# Altium project Microprocessor.PrjPcb
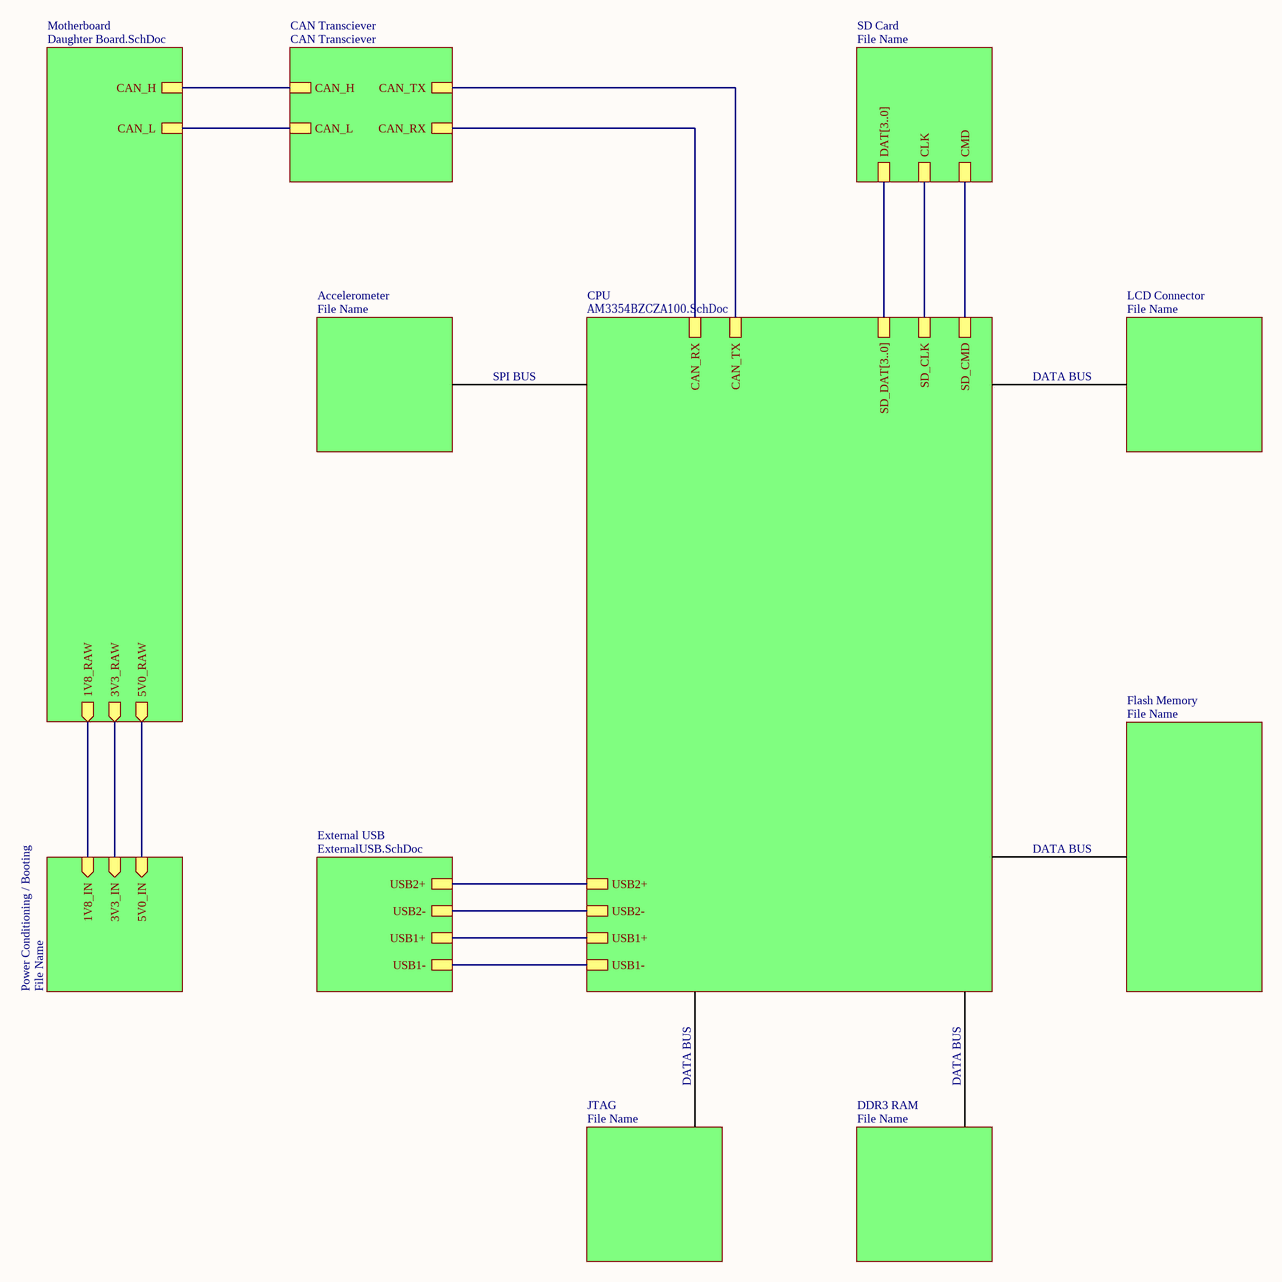
[diagram p0: BlockView.SchDoc]
8 sheets, 31 parts. Net scope: hierarchical (ports join the sheet entries above them; power ports are global).
Board file: Microprocessor.PcbDoc
Sheets:
  BlockView.SchDoc
    Motherboard = Daughter Board.SchDoc
  AM-Power.SchDoc
  AM-Config&LCD.SchDoc
  AM-Clock.SchDoc
  AM-IO.SchDoc
  AM-ExternalMemory.SchDoc
  AM-RAM.SchDoc

## Sheet BlockView.SchDoc
size C

### Sub-sheets
Accelerometer = File Name (file not in this document): no entries
CAN Transciever = CAN Transciever (file not in this document): CAN_H, CAN_L, CAN_TX, CAN_RX
CPU = AM3354BZCZA100​.SchDoc (file not in this document): USB2+, USB2-, CAN_TX, CAN_RX, SD_DAT[3..0], SD_CLK, SD_CMD, USB1+, USB1-
DDR3 RAM = File Name (file not in this document): no entries
External USB = ExternalUSB.SchDoc (file not in this document): USB2+, USB2-, USB1+, USB1-
Flash Memory = File Name (file not in this document): no entries
JTAG = File Name (file not in this document): no entries
LCD Connector = File Name (file not in this document): no entries
Motherboard = Daughter Board.SchDoc: CAN_H, CAN_L, 1V8_RAW (out), 5V0_RAW (out), 3V3_RAW (out)
Power Conditioning / Booting = File Name (file not in this document): 1V8_IN (in), 3V3_IN (in), 5V0_IN (in)
SD Card = File Name (file not in this document): DAT[3..0], CLK, CMD

### Nets
(unnamed): sheet Motherboard/CAN_H, sheet CAN Transciever/CAN_H
(unnamed): sheet Motherboard/CAN_L, sheet CAN Transciever/CAN_L
(unnamed): sheet Motherboard/1V8_RAW, sheet Power Conditioning / Booting/1V8_IN
(unnamed): sheet Motherboard/5V0_RAW, sheet Power Conditioning / Booting/5V0_IN
(unnamed): sheet Motherboard/3V3_RAW, sheet Power Conditioning / Booting/3V3_IN
(unnamed): sheet CPU/USB2+, sheet External USB/USB2+
(unnamed): sheet CPU/USB2-, sheet External USB/USB2-
(unnamed): sheet CPU/CAN_TX, sheet CAN Transciever/CAN_TX
(unnamed): sheet CPU/CAN_RX, sheet CAN Transciever/CAN_RX
(unnamed): sheet CPU/SD_DAT[3..0], sheet SD Card/DAT[3..0]
(unnamed): sheet CPU/SD_CLK, sheet SD Card/CLK
(unnamed): sheet CPU/SD_CMD, sheet SD Card/CMD
(unnamed): sheet CPU/USB1+, sheet External USB/USB1+
(unnamed): sheet CPU/USB1-, sheet External USB/USB1-

### Notes on the sheet
- SPI BUS
- DATA BUS

## Sheet Daughter Board.SchDoc
size A
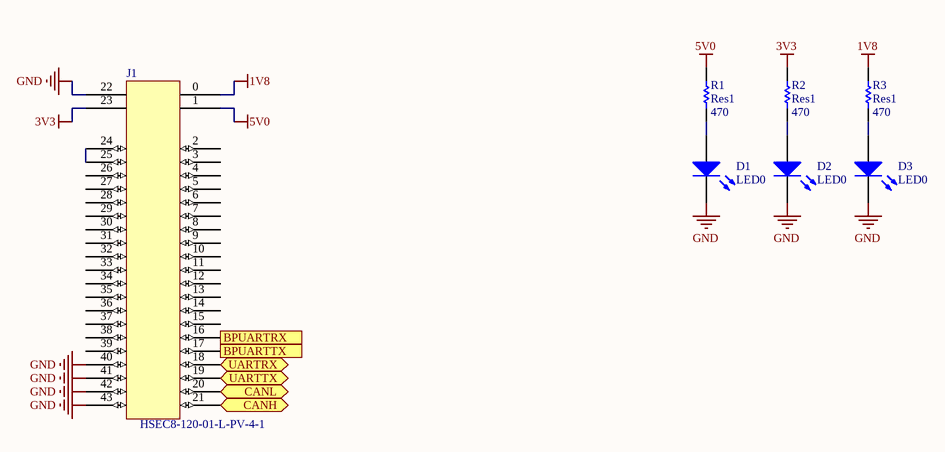
[diagram p1: Daughter Board.SchDoc]

### Parts
D1  LED0  [1608[0603]]
D2  LED0  [1608[0603]]
D3  LED0  [1608[0603]]
J1  HSEC8-120-01-L-PV-4-1  [HSEC8-120-01-L-PV-4-1 Gold Fingers]
R1  Res1  value 470  [1608[0603]]
R2  Res1  value 470  [1608[0603]]
R3  Res1  value 470  [1608[0603]]

### Ports
BPUARTRX (out), BPUARTTX (in), CANH (bidir), CANL (bidir), UARTRX (bidir), UARTTX (bidir)

### Nets
1V8: J1.0 R3.2
3V3: J1.23 R2.2
5V0: J1.1 R1.2
GND: D1.2(K) D2.2(K) D3.2(K) J1.22 J1.40 J1.41 J1.42 J1.43
NetD1_1: D1.1(A) R1.1
NetD2_1: D2.1(A) R2.1
NetD3_1: D3.1(A) R3.1
NetJ1_16: J1.16 ; port BPUARTRX
NetJ1_17: J1.17 ; port BPUARTTX
NetJ1_18: J1.18 ; port UARTRX
NetJ1_19: J1.19 ; port UARTTX
NetJ1_20: J1.20 ; port CANL
NetJ1_21: J1.21 ; port CANH
NetJ1_24: J1.24 J1.25

Not connected (* = marked no-connect by the designer): J1 2(0) 3(0) 4(0) 5(0) 6(0) 7(0) 8(0) 9(0) 10(0) 11(0) 12(0) 13(0) 14(0) 15(0) 26 27 28 29 30 31 32 33 34 35 36 37 38 39

### Library data of the parts
R1-R3 = Res1: Resistor; Published: 8-Jun-2000; LatestRevisionDate: 17-Jul-2002; LatestRevisionNote: Re-released for DXP Platform.; PackageReference: AXIAL-0.3; Publisher: Altium Limited; PackageDescription: Axial Device, Thru-Hole; 2 Leads; 0.3 in Pin Spacing
D1-D3 = LED0: Published: 8-Jun-2000; LatestRevisionDate: 08-Jul-2005; LatestRevisionNote: Mech Layer 1 removed.; PackageReference: LED-0; Publisher: Altium Limited; PackageDescription: LED; 2 Leads
J1 = HSEC8-120-01-L-PV-4-1: Supplier 1: Mouser

## Sheet AM-Power.SchDoc
size C
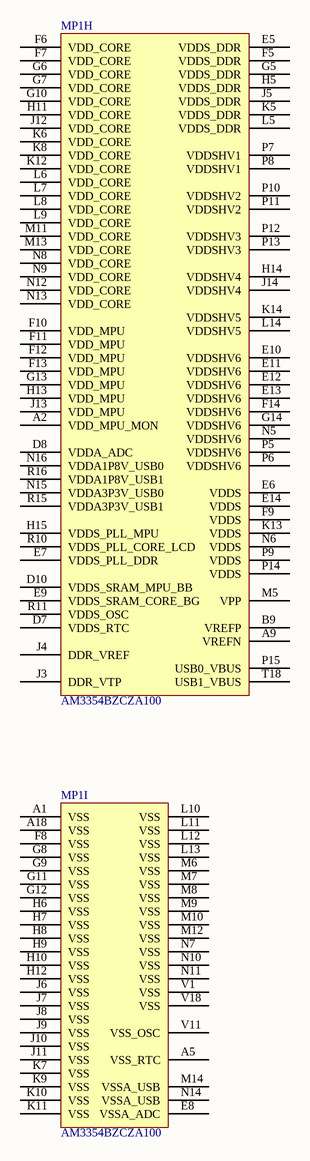
[diagram p2: AM-Power.SchDoc]

### Parts
MP1  AM3354BZCZA100  [TI-ZCZ324]  (parts H,I of 9)

### Nets

Not connected (* = marked no-connect by the designer): MP1 A1(VSS) A2(VDD_MPU_MON) A5(VSS_RTC) A9(VREFN) A18(VSS) B9(VREFP) D7(VDDS_RTC) D8(VDDA_ADC) D10(VDDS_SRAM_MPU_BB) E5(VDDS_DDR) E6(VDDS) E7(VDDS_PLL_DDR) E8(VSSA_ADC) E9(VDDS_SRAM_CORE_BG) E10(VDDSHV6) E11(VDDSHV6) E12(VDDSHV6) E13(VDDSHV6) E14(VDDS) F5(VDDS_DDR) F6(VDD_CORE) F7(VDD_CORE) F8(VSS) F9(VDDS) F10(VDD_MPU) F11(VDD_MPU) F12(VDD_MPU) F13(VDD_MPU) F14(VDDSHV6) G5(VDDS_DDR) G6(VDD_CORE) G7(VDD_CORE) G8(VSS) G9(VSS) G10(VDD_CORE) G11(VSS) G12(VSS) G13(VDD_MPU) G14(VDDSHV6) H5(VDDS_DDR) H6(VSS) H7(VSS) H8(VSS) H9(VSS) H10(VSS) H11(VDD_CORE) H12(VSS) H13(VDD_MPU) H14(VDDSHV4) H15(VDDS_PLL_MPU) J3(DDR_VTP) J4(DDR_VREF) J5(VDDS_DDR) J6(VSS) J7(VSS) J8(VSS) J9(VSS) J10(VSS) J11(VSS) J12(VDD_CORE) J13(VDD_MPU) J14(VDDSHV4) K5(VDDS_DDR) K6(VDD_CORE) K7(VSS) K8(VDD_CORE) K9(VSS) K10(VSS) K11(VSS) K12(VDD_CORE) K13(VDDS) K14(VDDSHV5) L5(VDDS_DDR) L6(VDD_CORE) L7(VDD_CORE) L8(VDD_CORE) L9(VDD_CORE) L10(VSS) L11(VSS) L12(VSS) L13(VSS) L14(VDDSHV5) M5(VPP) M6(VSS) M7(VSS) M8(VSS) M9(VSS) M10(VSS) M11(VDD_CORE) M12(VSS) M13(VDD_CORE) M14(VSSA_USB) N5(VDDSHV6) N6(VDDS) N7(VSS) N8(VDD_CORE) N9(VDD_CORE) N10(VSS) N11(VSS) N12(VDD_CORE) N13(VDD_CORE) N14(VSSA_USB) N15(VDDA3P3V_USB0) N16(VDDA1P8V_USB0) P5(VDDSHV6) P6(VDDSHV6) P7(VDDSHV1) P8(VDDSHV1) P9(VDDS) P10(VDDSHV2) P11(VDDSHV2) P12(VDDSHV3) P13(VDDSHV3) P14(VDDS) P15(USB0_VBUS) R10(VDDS_PLL_CORE_LCD) R11(VDDS_OSC) R15(VDDA3P3V_USB1) R16(VDDA1P8V_USB1) T18(USB1_VBUS) V1(VSS) V11(VSS_OSC) V18(VSS)

### Notes on the sheet
- Title
- Size:
- Date:
- File:
- C
- Number:
- Time:
- Revision:
- Sheet
- of

### Library data of the parts
MP1 = CMP-0547-00017-2: Sitara ARM Cortex-A8 32-Bit RISC Microprocessor, 1 GHz, SGX530 3D Graphics Engine, Programmable Real-Time Unit and Industrial Communication Subsystem (PRU-ICSS), -40 to 105 degC, 324-pin NFBGA (ZCZ), Green (RoHS & no Sb/Br); Manufacturer: Texas Instruments; eQEP: 3; CAN: 2; UART (SCI): 6; ComponentLink2Description: Datasheet; Mounting Technology: Surface Mount; ComponentLink3Description: Package Specification; Operating Temperature: -40 to 105 degC; PackageReference: ZCZ324; ComponentLink3URL: http://www.ti.com/lit/ds/symlink/am3352.pdf; ARM CPU: Cortex-A8; SPI: 2; ComponentLink2URL: http://www.ti.com/lit/ds/symlink/am3352.pdf; ComponentLink1URL: http://www.ti.com/; PackageVersion: 4211570/A; DatasheetVersion: SPRS717F; eCAP: 3; ComponentLink1Description: Manufacturer URL; PartNumber: AM3354BZCZA100; I2C: 3; PackageDescription: 324-Pin Plastic Ball Grid Array, Body 15 x 15 mm, Pitch 0.8 mm

## Sheet AM-Config&LCD.SchDoc
size A
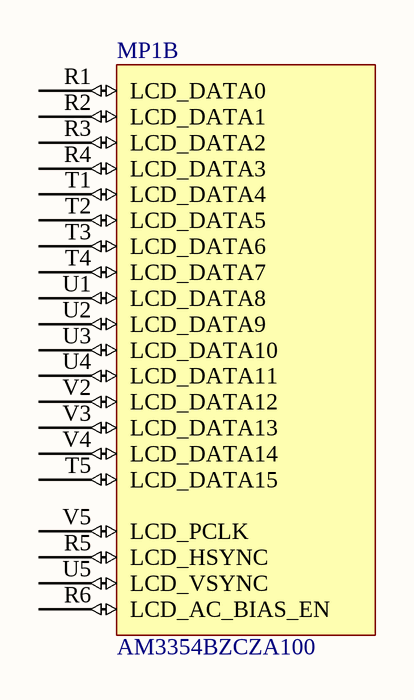
[diagram p3: AM-Config&LCD.SchDoc]

### Parts
MP1  AM3354BZCZA100  [TI-ZCZ324]  (part B of 9)

### Nets

Not connected (* = marked no-connect by the designer): MP1 R1(LCD_DATA0) R2(LCD_DATA1) R3(LCD_DATA2) R4(LCD_DATA3) R5(LCD_HSYNC) R6(LCD_AC_BIAS_EN) T1(LCD_DATA4) T2(LCD_DATA5) T3(LCD_DATA6) T4(LCD_DATA7) T5(LCD_DATA15) U1(LCD_DATA8) U2(LCD_DATA9) U3(LCD_DATA10) U4(LCD_DATA11) U5(LCD_VSYNC) V2(LCD_DATA12) V3(LCD_DATA13) V4(LCD_DATA14) V5(LCD_PCLK)

### Library data of the parts
MP1 = CMP-0547-00017-2: as MP1 on sheet AM-Power; ComponentLink2Description: Datasheet; Mounting Technology: Surface Mount; ComponentLink3Description: Package Specification; Operating Temperature: -40 to 105 degC; PackageReference: ZCZ324; ComponentLink3URL: http://www.ti.com/lit/ds/symlink/am3352.pdf; ARM CPU: Cortex-A8; SPI: 2; ComponentLink2URL: http://www.ti.com/lit/ds/symlink/am3352.pdf; ComponentLink1URL: http://www.ti.com/; PackageVersion: 4211570/A; DatasheetVersion: SPRS717F; eCAP: 3; ComponentLink1Description: Manufacturer URL; PartNumber: AM3354BZCZA100; I2C: 3; PackageDescription: 324-Pin Plastic Ball Grid Array, Body 15 x 15 mm, Pitch 0.8 mm

## Sheet AM-Clock.SchDoc
size A
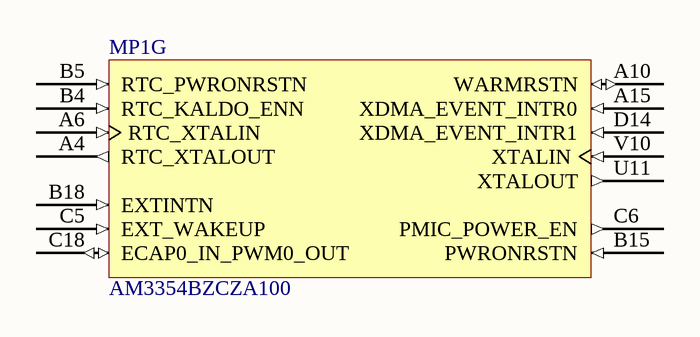
[diagram p4: AM-Clock.SchDoc]

### Parts
MP1  AM3354BZCZA100  [TI-ZCZ324]  (part G of 9)

### Nets

Not connected (* = marked no-connect by the designer): MP1 A4(RTC_XTALOUT) A6(RTC_XTALIN) A10(WARMRSTN) A15(XDMA_EVENT_INTR0) B4(RTC_KALDO_ENN) B5(RTC_PWRONRSTN) B15(PWRONRSTN) B18(EXTINTN) C5(EXT_WAKEUP) C6(PMIC_POWER_EN) C18(ECAP0_IN_PWM0_OUT) D14(XDMA_EVENT_INTR1) U11(XTALOUT) V10(XTALIN)

### Library data of the parts
MP1 = CMP-0547-00017-2: as MP1 on sheet AM-Power; ComponentLink2Description: Datasheet; Mounting Technology: Surface Mount; ComponentLink3Description: Package Specification; Operating Temperature: -40 to 105 degC; PackageReference: ZCZ324; ComponentLink3URL: http://www.ti.com/lit/ds/symlink/am3352.pdf; ARM CPU: Cortex-A8; SPI: 2; ComponentLink2URL: http://www.ti.com/lit/ds/symlink/am3352.pdf; ComponentLink1URL: http://www.ti.com/; PackageVersion: 4211570/A; DatasheetVersion: SPRS717F; eCAP: 3; ComponentLink1Description: Manufacturer URL; PartNumber: AM3354BZCZA100; I2C: 3; PackageDescription: 324-Pin Plastic Ball Grid Array, Body 15 x 15 mm, Pitch 0.8 mm

## Sheet AM-IO.SchDoc
size A
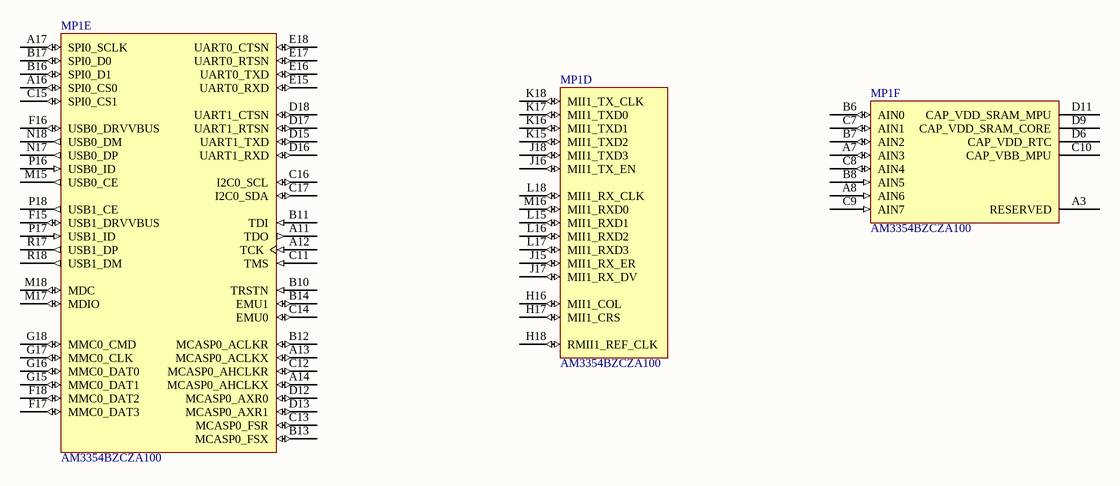
[diagram p5: AM-IO.SchDoc]

### Parts
MP1  AM3354BZCZA100  [TI-ZCZ324]  (parts D,E,F of 9)

### Nets

Not connected (* = marked no-connect by the designer): MP1 A3(RESERVED) A7(AIN3) A8(AIN6) A11(TDO) A12(TCK) A13(MCASP0_ACLKX) A14(MCASP0_AHCLKX) A16(SPI0_CS0) A17(SPI0_SCLK) B6(AIN0) B7(AIN2) B8(AIN5) B10(TRSTN) B11(TDI) B12(MCASP0_ACLKR) B13(MCASP0_FSX) B14(EMU1) B16(SPI0_D1) B17(SPI0_D0) C7(AIN1) C8(AIN4) C9(AIN7) C10(CAP_VBB_MPU) C11(TMS) C12(MCASP0_AHCLKR) C13(MCASP0_FSR) C14(EMU0) C15(SPI0_CS1) C16(I2C0_SCL) C17(I2C0_SDA) D6(CAP_VDD_RTC) D9(CAP_VDD_SRAM_CORE) D11(CAP_VDD_SRAM_MPU) D12(MCASP0_AXR0) D13(MCASP0_AXR1) D15(UART1_TXD) D16(UART1_RXD) D17(UART1_RTSN) D18(UART1_CTSN) E15(UART0_RXD) E16(UART0_TXD) E17(UART0_RTSN) E18(UART0_CTSN) F15(USB1_DRVVBUS) F16(USB0_DRVVBUS) F17(MMC0_DAT3) F18(MMC0_DAT2) G15(MMC0_DAT1) G16(MMC0_DAT0) G17(MMC0_CLK) G18(MMC0_CMD) H16(MII1_COL) H17(MII1_CRS) H18(RMII1_REF_CLK) J15(MII1_RX_ER) J16(MII1_TX_EN) J17(MII1_RX_DV) J18(MII1_TXD3) K15(MII1_TXD2) K16(MII1_TXD1) K17(MII1_TXD0) K18(MII1_TX_CLK) L15(MII1_RXD1) L16(MII1_RXD2) L17(MII1_RXD3) L18(MII1_RX_CLK) M15(USB0_CE) M16(MII1_RXD0) M17(MDIO) M18(MDC) N17(USB0_DP) N18(USB0_DM) P16(USB0_ID) P17(USB1_ID) P18(USB1_CE) R17(USB1_DP) R18(USB1_DM)

### Library data of the parts
MP1 = CMP-0547-00017-2: as MP1 on sheet AM-Power; ComponentLink2Description: Datasheet; Mounting Technology: Surface Mount; ComponentLink3Description: Package Specification; Operating Temperature: -40 to 105 degC; PackageReference: ZCZ324; ComponentLink3URL: http://www.ti.com/lit/ds/symlink/am3352.pdf; ARM CPU: Cortex-A8; SPI: 2; ComponentLink2URL: http://www.ti.com/lit/ds/symlink/am3352.pdf; ComponentLink1URL: http://www.ti.com/; PackageVersion: 4211570/A; DatasheetVersion: SPRS717F; eCAP: 3; ComponentLink1Description: Manufacturer URL; PartNumber: AM3354BZCZA100; I2C: 3; PackageDescription: 324-Pin Plastic Ball Grid Array, Body 15 x 15 mm, Pitch 0.8 mm

## Sheet AM-ExternalMemory.SchDoc
size A
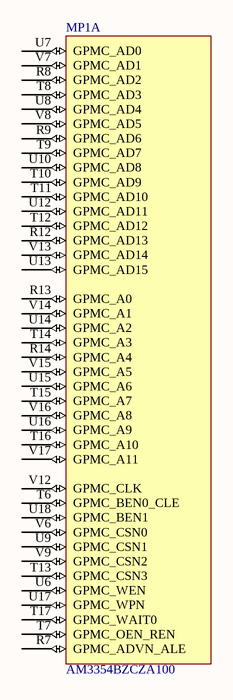
[diagram p6: AM-ExternalMemory.SchDoc]

### Parts
MP1  AM3354BZCZA100  [TI-ZCZ324]  (part A of 9)

### Nets

Not connected (* = marked no-connect by the designer): MP1 R7(GPMC_ADVN_ALE) R8(GPMC_AD2) R9(GPMC_AD6) R12(GPMC_AD13) R13(GPMC_A0) R14(GPMC_A4) T6(GPMC_BEN0_CLE) T7(GPMC_OEN_REN) T8(GPMC_AD3) T9(GPMC_AD7) T10(GPMC_AD9) T11(GPMC_AD10) T12(GPMC_AD12) T13(GPMC_CSN3) T14(GPMC_A3) T15(GPMC_A7) T16(GPMC_A10) T17(GPMC_WAIT0) U6(GPMC_WEN) U7(GPMC_AD0) U8(GPMC_AD4) U9(GPMC_CSN1) U10(GPMC_AD8) U12(GPMC_AD11) U13(GPMC_AD15) U14(GPMC_A2) U15(GPMC_A6) U16(GPMC_A9) U17(GPMC_WPN) U18(GPMC_BEN1) V6(GPMC_CSN0) V7(GPMC_AD1) V8(GPMC_AD5) V9(GPMC_CSN2) V12(GPMC_CLK) V13(GPMC_AD14) V14(GPMC_A1) V15(GPMC_A5) V16(GPMC_A8) V17(GPMC_A11)

### Library data of the parts
MP1 = CMP-0547-00017-2: as MP1 on sheet AM-Power; ComponentLink2Description: Datasheet; Mounting Technology: Surface Mount; ComponentLink3Description: Package Specification; Operating Temperature: -40 to 105 degC; PackageReference: ZCZ324; ComponentLink3URL: http://www.ti.com/lit/ds/symlink/am3352.pdf; ARM CPU: Cortex-A8; SPI: 2; ComponentLink2URL: http://www.ti.com/lit/ds/symlink/am3352.pdf; ComponentLink1URL: http://www.ti.com/; PackageVersion: 4211570/A; DatasheetVersion: SPRS717F; eCAP: 3; ComponentLink1Description: Manufacturer URL; PartNumber: AM3354BZCZA100; I2C: 3; PackageDescription: 324-Pin Plastic Ball Grid Array, Body 15 x 15 mm, Pitch 0.8 mm

## Sheet AM-RAM.SchDoc
size B
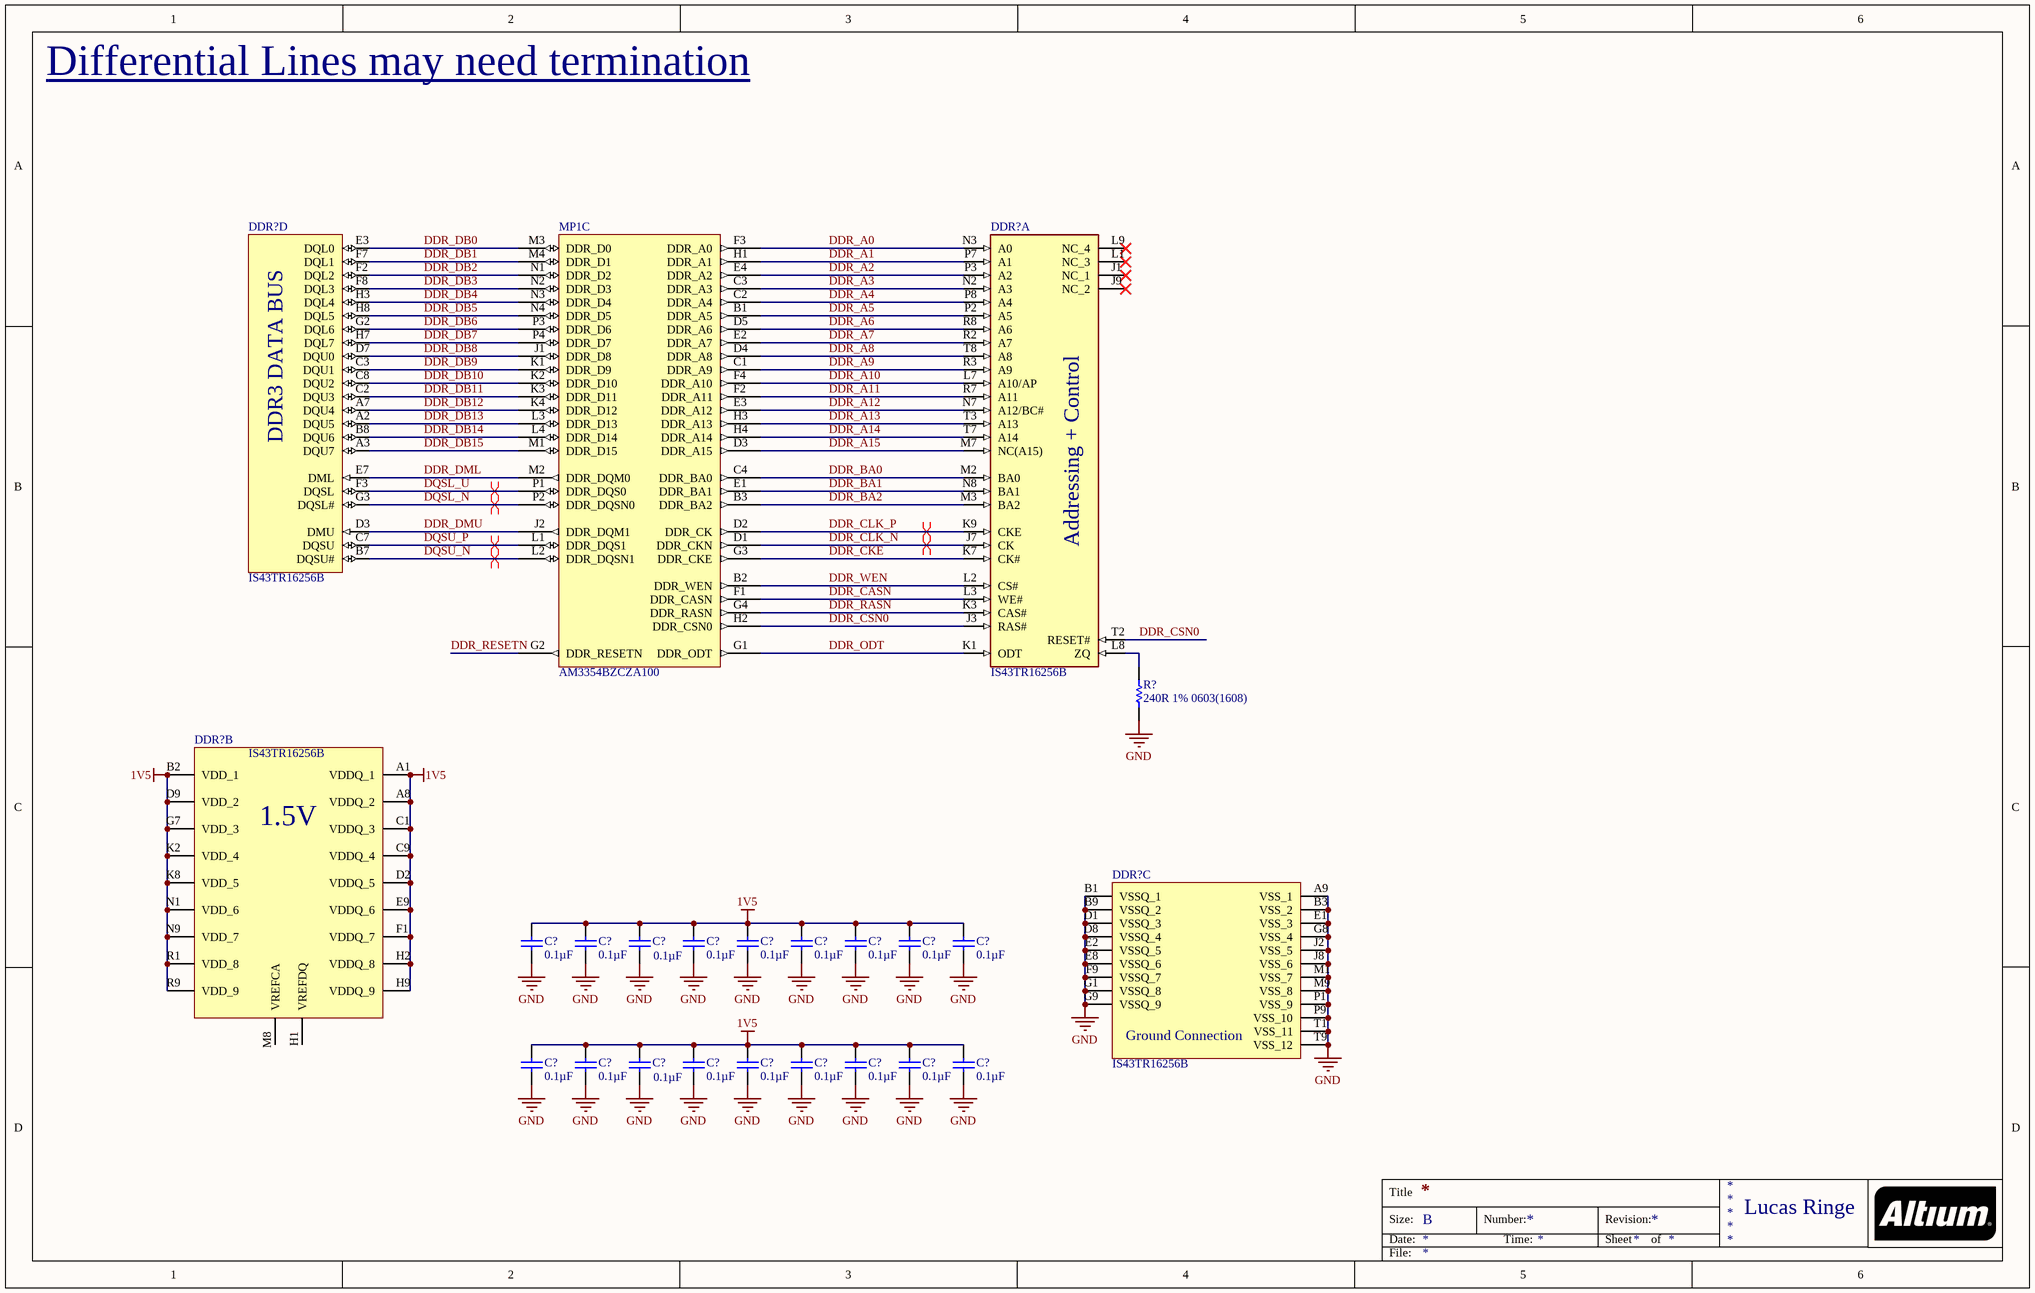
[diagram p7: AM-RAM.SchDoc]

### Parts
(Parts that share a designator on the sheet are numbered #1, #2 ... from top to bottom, then left to right.)
C?#1  Capacitance: 0.1µF  [SAMS-C0603-2_M]  (hidden comment: CL10B104KB8NNNC)
C?#2  Capacitance: 0.1µF  [SAMS-C0603-2_M]  (hidden comment: CL10B104KB8NNNC)
C?#3  Capacitance: 0.1µF  [SAMS-C0603-2_M]  (hidden comment: CL10B104KB8NNNC)
C?#4  Capacitance: 0.1µF  [SAMS-C0603-2_M]  (hidden comment: CL10B104KB8NNNC)
C?#5  Capacitance: 0.1µF  [SAMS-C0603-2_M]  (hidden comment: CL10B104KB8NNNC)
C?#6  Capacitance: 0.1µF  [SAMS-C0603-2_M]  (hidden comment: CL10B104KB8NNNC)
C?#7  Capacitance: 0.1µF  [SAMS-C0603-2_M]  (hidden comment: CL10B104KB8NNNC)
C?#8  Capacitance: 0.1µF  [SAMS-C0603-2_M]  (hidden comment: CL10B104KB8NNNC)
C?#9  Capacitance: 0.1µF  [SAMS-C0603-2_M]  (hidden comment: CL10B104KB8NNNC)
C?#10  Capacitance: 0.1µF  [SAMS-C0603-2_M]  (hidden comment: CL10B104KB8NNNC)
C?#11  Capacitance: 0.1µF  [SAMS-C0603-2_M]  (hidden comment: CL10B104KB8NNNC)
C?#12  Capacitance: 0.1µF  [SAMS-C0603-2_M]  (hidden comment: CL10B104KB8NNNC)
C?#13  Capacitance: 0.1µF  [SAMS-C0603-2_M]  (hidden comment: CL10B104KB8NNNC)
C?#14  Capacitance: 0.1µF  [SAMS-C0603-2_M]  (hidden comment: CL10B104KB8NNNC)
C?#15  Capacitance: 0.1µF  [SAMS-C0603-2_M]  (hidden comment: CL10B104KB8NNNC)
C?#16  Capacitance: 0.1µF  [SAMS-C0603-2_M]  (hidden comment: CL10B104KB8NNNC)
C?#17  Capacitance: 0.1µF  [SAMS-C0603-2_M]  (hidden comment: CL10B104KB8NNNC)
C?#18  Capacitance: 0.1µF  [SAMS-C0603-2_M]  (hidden comment: CL10B104KB8NNNC)
DDR?#1  IS43TR16256B  [BGA96C80P9X16_900X1300X120]  (part D of 4)
DDR?#2  IS43TR16256B  [BGA96C80P9X16_900X1300X120]  (part A of 4)
DDR?#3  IS43TR16256B  [BGA96C80P9X16_900X1300X120]  (part B of 4)
DDR?#4  IS43TR16256B  [BGA96C80P9X16_900X1300X120]  (part C of 4)
MP1  AM3354BZCZA100  [TI-ZCZ324]  (part C of 9)
R?  240R 1% 0603(1608)  [RESC0603(1608)_N]

### Nets
1V5: C?#1.2 C?#2.2 C?#3.2 C?#4.2 C?#5.2 C?#6.2 C?#7.2 C?#8.2 C?#9.2 C?#10.2 C?#11.2 C?#12.2 C?#13.2 C?#14.2 C?#15.2 C?#16.2 C?#17.2 C?#18.2 DDR?#3.A1(VDDQ_1) DDR?#3.A8(VDDQ_2) DDR?#3.B2(VDD_1) DDR?#3.C1(VDDQ_3) DDR?#3.C9(VDDQ_4) DDR?#3.D2(VDDQ_5) DDR?#3.D9(VDD_2) DDR?#3.E9(VDDQ_6) DDR?#3.F1(VDDQ_7) DDR?#3.G7(VDD_3) DDR?#3.H2(VDDQ_8) DDR?#3.H9(VDDQ_9) DDR?#3.K2(VDD_4) DDR?#3.K8(VDD_5) DDR?#3.N1(VDD_6) DDR?#3.N9(VDD_7) DDR?#3.R1(VDD_8) DDR?#3.R9(VDD_9)
GND: C?#1.1 C?#2.1 C?#3.1 C?#4.1 C?#5.1 C?#6.1 C?#7.1 C?#8.1 C?#9.1 C?#10.1 C?#11.1 C?#12.1 C?#13.1 C?#14.1 C?#15.1 C?#16.1 C?#17.1 C?#18.1 DDR?#4.A9(VSS_1) DDR?#4.B1(VSSQ_1) DDR?#4.B3(VSS_2) DDR?#4.B9(VSSQ_2) DDR?#4.D1(VSSQ_3) DDR?#4.D8(VSSQ_4) DDR?#4.E1(VSS_3) DDR?#4.E2(VSSQ_5) DDR?#4.E8(VSSQ_6) DDR?#4.F9(VSSQ_7) DDR?#4.G1(VSSQ_8) DDR?#4.G8(VSS_4) DDR?#4.G9(VSSQ_9) DDR?#4.J2(VSS_5) DDR?#4.J8(VSS_6) DDR?#4.M1(VSS_7) DDR?#4.M9(VSS_8) DDR?#4.P1(VSS_9) DDR?#4.P9(VSS_10) DDR?#4.T1(VSS_11) DDR?#4.T9(VSS_12) R?.1
DDR_A0: DDR?#2.N3(A0) MP1.F3(DDR_A0)
DDR_A1: DDR?#2.P7(A1) MP1.H1(DDR_A1)
DDR_A2: DDR?#2.P3(A2) MP1.E4(DDR_A2)
DDR_A3: DDR?#2.N2(A3) MP1.C3(DDR_A3)
DDR_A4: DDR?#2.P8(A4) MP1.C2(DDR_A4)
DDR_A5: DDR?#2.P2(A5) MP1.B1(DDR_A5)
DDR_A6: DDR?#2.R8(A6) MP1.D5(DDR_A6)
DDR_A7: DDR?#2.R2(A7) MP1.E2(DDR_A7)
DDR_A8: DDR?#2.T8(A8) MP1.D4(DDR_A8)
DDR_A9: DDR?#2.R3(A9) MP1.C1(DDR_A9)
DDR_A10: DDR?#2.L7(A10/AP) MP1.F4(DDR_A10)
DDR_A11: DDR?#2.R7(A11) MP1.F2(DDR_A11)
DDR_A1~{2}: DDR?#2.N7(A12/BC#) MP1.E3(DDR_A12)
DDR_A13: DDR?#2.T3(A13) MP1.H3(DDR_A13)
DDR_A14: DDR?#2.T7(A14) MP1.H4(DDR_A14)
DDR_A15: DDR?#2.M7(NC(A15)) MP1.D3(DDR_A15)
DDR_BA0: DDR?#2.M2(BA0) MP1.C4(DDR_BA0)
DDR_BA1: DDR?#2.N8(BA1) MP1.E1(DDR_BA1)
DDR_BA2: DDR?#2.M3(BA2) MP1.B3(DDR_BA2)
DDR_CASN: DDR?#2.L3(WE#) MP1.F1(DDR_CASN)
DDR_CKE: DDR?#2.K7(CK#) MP1.G3(DDR_CKE)
DDR_CLK_N: DDR?#2.J7(CK) MP1.D1(DDR_CKN)
DDR_CLK_P: DDR?#2.K9(CKE) MP1.D2(DDR_CK)
DDR_CSN0: DDR?#2.J3(RAS#) DDR?#2.T2(RESET#) MP1.H2(DDR_CSN0)
DDR_DB0: DDR?#1.E3(DQL0) MP1.M3(DDR_D0)
DDR_DB1: DDR?#1.F7(DQL1) MP1.M4(DDR_D1)
DDR_DB2: DDR?#1.F2(DQL2) MP1.N1(DDR_D2)
DDR_DB3: DDR?#1.F8(DQL3) MP1.N2(DDR_D3)
DDR_DB4: DDR?#1.H3(DQL4) MP1.N3(DDR_D4)
DDR_DB5: DDR?#1.H8(DQL5) MP1.N4(DDR_D5)
DDR_DB6: DDR?#1.G2(DQL6) MP1.P3(DDR_D6)
DDR_DB7: DDR?#1.H7(DQL7) MP1.P4(DDR_D7)
DDR_DB8: DDR?#1.D7(DQU0) MP1.J1(DDR_D8)
DDR_DB9: DDR?#1.C3(DQU1) MP1.K1(DDR_D9)
DDR_DB10: DDR?#1.C8(DQU2) MP1.K2(DDR_D10)
DDR_DB11: DDR?#1.C2(DQU3) MP1.K3(DDR_D11)
DDR_DB12: DDR?#1.A7(DQU4) MP1.K4(DDR_D12)
DDR_DB13: DDR?#1.A2(DQU5) MP1.L3(DDR_D13)
DDR_DB14: DDR?#1.B8(DQU6) MP1.L4(DDR_D14)
DDR_DB15: DDR?#1.A3(DQU7) MP1.M1(DDR_D15)
DDR_DML: DDR?#1.E7(DML) MP1.M2(DDR_DQM0)
DDR_DMU: DDR?#1.D3(DMU) MP1.J2(DDR_DQM1)
DDR_ODT: DDR?#2.K1(ODT) MP1.G1(DDR_ODT)
DDR_RASN: DDR?#2.K3(CAS#) MP1.G4(DDR_RASN)
DDR_RESETN: MP1.G2(DDR_RESETN)
DDR_WEN: DDR?#2.L2(CS#) MP1.B2(DDR_WEN)
DQSL_N: DDR?#1.G3(DQSL#) MP1.P2(DDR_DQSN0)
DQSL_U: DDR?#1.F3(DQSL) MP1.P1(DDR_DQS0)
DQSU_N: DDR?#1.B7(DQSU#) MP1.L2(DDR_DQSN1)
DQSU_P: DDR?#1.C7(DQSU) MP1.L1(DDR_DQS1)
NetDDR?#2_L8: DDR?#2.L8(ZQ) R?.2

Not connected (* = marked no-connect by the designer): DDR?#2 J1(NC_1)* J9(NC_2)* L1(NC_3)* L9(NC_4)*; DDR?#3 H1(VREFDQ) M8(VREFCA)

### Layout directives
differential pair: DDR_CLK_N, DDR_CLK_P, DQSL_N, DQSL_U, DQSU_N, DQSU_P

### Notes on the sheet
- Differential Lines may need termination <https://www.nxp.com/files-static/32bit/doc/app_note/AN3940.pdf>
- Lucas Ringe
- Title
- Size:
- Date:
- B
- Number:
- Time:
- Revision:
- Sheet
- of
- File:
- (in symbol IS43TR16256B, part A) Addressing + Control
- (in symbol IS43TR16256B, part B) 1.5V
- (in symbol IS43TR16256B, part C) Ground Connection
- (in symbol IS43TR16256B, part D) DDR3 DATA BUS

### Library data of the parts
C?#1-C?#18 = CMP-2000-05332-1: Multi-layer Ceramic Capacitor, -55 to 125 degC, 2-Pin SMD (0603), RoHS, Tape and Reel; Manufacturer: Samsung Electro-Mechanics; Rated Voltage: 50V; Dielectric: X7R; Tolerance (%): ±10%; Case Size/Dimension: 0603; Datasheet URL: https://datasheet.ciiva.com/29198/456651-da-01-en-vs-kondensator-0605-29198839.pdf; Manufacturer URL: http://www.samsungsem.com/global/index.jsp; Datasheet Version: Nov-10
DDR?#1-DDR?#4 = IS43TR16256B: Integrated Circuit; Manufacturer_Name: Integrated Silicon Solution Inc.; Manufacturer_Part_Number: IS43TR16256B-125KBL; Datasheet Link: https://componentsearchengine.com//IS43TR16256B-125KBL.pdf; Height: 1.2mm; Mouser2 Part Number: 870-43T16256B125KBL; Mouser2 Price/Stock: https://www.mouser.com/Search/Refine.aspx?Keyword=870-43T16256B125KBL
MP1 = CMP-0547-00017-2: as MP1 on sheet AM-Power; ComponentLink2Description: Datasheet; Mounting Technology: Surface Mount; ComponentLink3Description: Package Specification; Operating Temperature: -40 to 105 degC; PackageReference: ZCZ324; ComponentLink3URL: http://www.ti.com/lit/ds/symlink/am3352.pdf; ARM CPU: Cortex-A8; SPI: 2; ComponentLink2URL: http://www.ti.com/lit/ds/symlink/am3352.pdf; ComponentLink1URL: http://www.ti.com/; PackageVersion: 4211570/A; DatasheetVersion: SPRS717F; eCAP: 3; ComponentLink1Description: Manufacturer URL; PartNumber: AM3354BZCZA100; I2C: 3; PackageDescription: 324-Pin Plastic Ball Grid Array, Body 15 x 15 mm, Pitch 0.8 mm
R? = CMP-1012-00438-1: 240R 0.1W 1% 0603 (1608 Metric)  SMD; Case-EIA: 0603; Value: 240.00 Ohm; Case-Metric: 1608; Technology: SMT; Power: 0.1 W; Tolerance: 1 %

## Nets that join several sheets
GND: Daughter Board (8 pins), AM-RAM (40 pins)